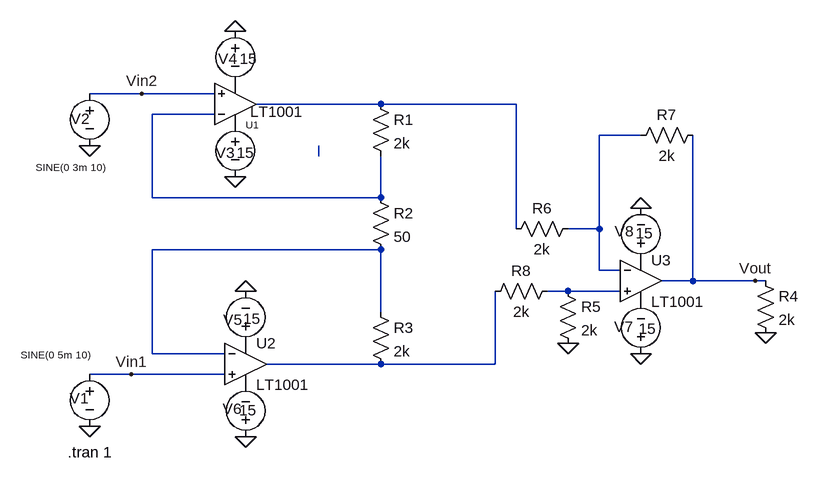
[diagram p0: schematic 8.instruementation amplifier.asc]
8.instruementation amplifier.asc, the LTspice schematic file:
Version 4
SHEET 1 984 680
WIRE -48 -48 -128 -48
WIRE 64 -48 -48 -48
WIRE 320 -32 128 -32
WIRE 528 -32 320 -32
WIRE 64 -16 -32 -16
WIRE 720 16 656 16
WIRE 224 48 224 32
WIRE -32 112 -32 -16
WIRE 320 112 320 48
WIRE 320 112 -32 112
WIRE 528 160 528 -32
WIRE 656 160 656 16
WIRE 656 160 608 160
WIRE 320 192 -32 192
WIRE 656 224 656 160
WIRE 688 224 656 224
WIRE 800 240 800 16
WIRE 800 240 752 240
WIRE 896 240 800 240
WIRE 912 240 896 240
WIRE 608 256 576 256
WIRE 688 256 608 256
WIRE 320 288 320 192
WIRE -32 352 -32 192
WIRE 80 352 -32 352
WIRE 320 368 144 368
WIRE 496 368 496 256
WIRE 496 368 320 368
WIRE -64 384 -128 384
WIRE 80 384 -64 384
FLAG 96 80 0
FLAG 96 -144 0
FLAG -128 32 0
FLAG -128 464 0
FLAG 112 256 0
FLAG 112 480 0
FLAG 720 352 0
FLAG 608 336 0
FLAG 912 320 0
FLAG 720 128 0
FLAG 896 240 Vout
FLAG -64 384 Vin1
FLAG -48 -48 Vin2
SYMBOL OpAmps\\LT1001 96 32 M180
WINDOW 0 16 32 Left 1
WINDOW 3 23 52 Left 2
SYMATTR InstName U1
SYMBOL OpAmps\\LT1001 112 304 R0
SYMATTR InstName U2
SYMBOL OpAmps\\LT1001 720 176 R0
SYMATTR InstName U3
SYMBOL res 304 -48 R0
SYMATTR InstName R1
SYMATTR Value 2k
SYMBOL res 304 96 R0
SYMATTR InstName R2
SYMATTR Value 50
SYMBOL res 304 272 R0
SYMATTR InstName R3
SYMATTR Value 2k
SYMBOL res 896 224 R0
SYMATTR InstName R4
SYMATTR Value 2k
SYMBOL res 592 240 R0
SYMATTR InstName R5
SYMATTR Value 2k
SYMBOL res 624 144 R90
WINDOW 0 0 56 VBottom 2
WINDOW 3 32 56 VTop 2
SYMATTR InstName R6
SYMATTR Value 2k
SYMBOL res 816 0 R90
WINDOW 0 0 56 VBottom 2
WINDOW 3 32 56 VTop 2
SYMATTR InstName R7
SYMATTR Value 2k
SYMBOL res 592 240 R90
WINDOW 0 0 56 VBottom 2
WINDOW 3 32 56 VTop 2
SYMATTR InstName R8
SYMATTR Value 2k
SYMBOL voltage -128 368 R0
WINDOW 0 -31 53 Left 2
WINDOW 3 -106 -14 Left 1
WINDOW 123 0 0 Left 0
WINDOW 39 0 0 Left 0
SYMATTR InstName V1
SYMATTR Value SINE(0 5m 10)
SYMBOL voltage -128 -64 R0
WINDOW 0 -29 55 Left 2
WINDOW 3 -83 129 Left 1
WINDOW 123 0 0 Left 0
WINDOW 39 0 0 Left 0
SYMATTR InstName V2
SYMATTR Value SINE(0 3m 10)
SYMBOL voltage 96 -16 R0
WINDOW 0 -30 59 Left 2
WINDOW 3 2 59 Left 2
SYMATTR InstName V3
SYMATTR Value 15
SYMBOL voltage 96 -160 R0
WINDOW 0 -26 58 Left 2
WINDOW 3 7 58 Left 2
WINDOW 123 0 0 Left 0
WINDOW 39 0 0 Left 0
SYMATTR InstName V4
SYMATTR Value 15
SYMBOL voltage 112 352 R180
WINDOW 0 5 52 Left 2
WINDOW 3 -23 54 Left 2
WINDOW 123 0 0 Left 0
WINDOW 39 0 0 Left 0
SYMATTR InstName V5
SYMATTR Value 15
SYMBOL voltage 112 496 R180
WINDOW 0 6 59 Left 2
WINDOW 3 -17 57 Left 2
WINDOW 123 0 0 Left 0
WINDOW 39 0 0 Left 0
SYMATTR InstName V6
SYMATTR Value 15
SYMBOL voltage 720 368 R180
WINDOW 0 12 57 Left 2
WINDOW 3 -24 54 Left 2
WINDOW 123 0 0 Left 0
WINDOW 39 0 0 Left 0
SYMATTR InstName V7
SYMATTR Value 15
SYMBOL voltage 720 224 R180
WINDOW 0 11 60 Left 2
WINDOW 3 -19 57 Left 2
WINDOW 123 0 0 Left 0
WINDOW 39 0 0 Left 0
SYMATTR InstName V8
SYMATTR Value 15
TEXT -162 504 Left 2 !.tran 1

The netlist it stands for:
* 8.instruementation amplifier.asc
XU1 Vin2 N002 P001 P002 N001 LT1001  ; pins In+ In- V+ V- OUT
XU2 Vin1 N005 P003 P004 N007 LT1001  ; pins In+ In- V+ V- OUT
XU3 N006 N003 P005 P006 Vout LT1001  ; pins In+ In- V+ V- OUT
R1 N001 N002 2k
R2 N002 N005 50
R3 N005 N007 2k
R4 Vout 0 2k
R5 N006 0 2k
R6 N003 N001 2k
R7 Vout N003 2k
R8 N006 N007 2k
V1 Vin1 0 SINE(0 5m 10)
V2 Vin2 0 SINE(0 3m 10)
V3 P001 0 15
V4 0 P002 15
V5 P003 0 15
V6 0 P004 15
V7 0 P006 15
V8 P005 0 15
.tran 1
.lib LTC.lib
.backanno
.end